# EAGLE design untitled (EAGLE 7.2.0)
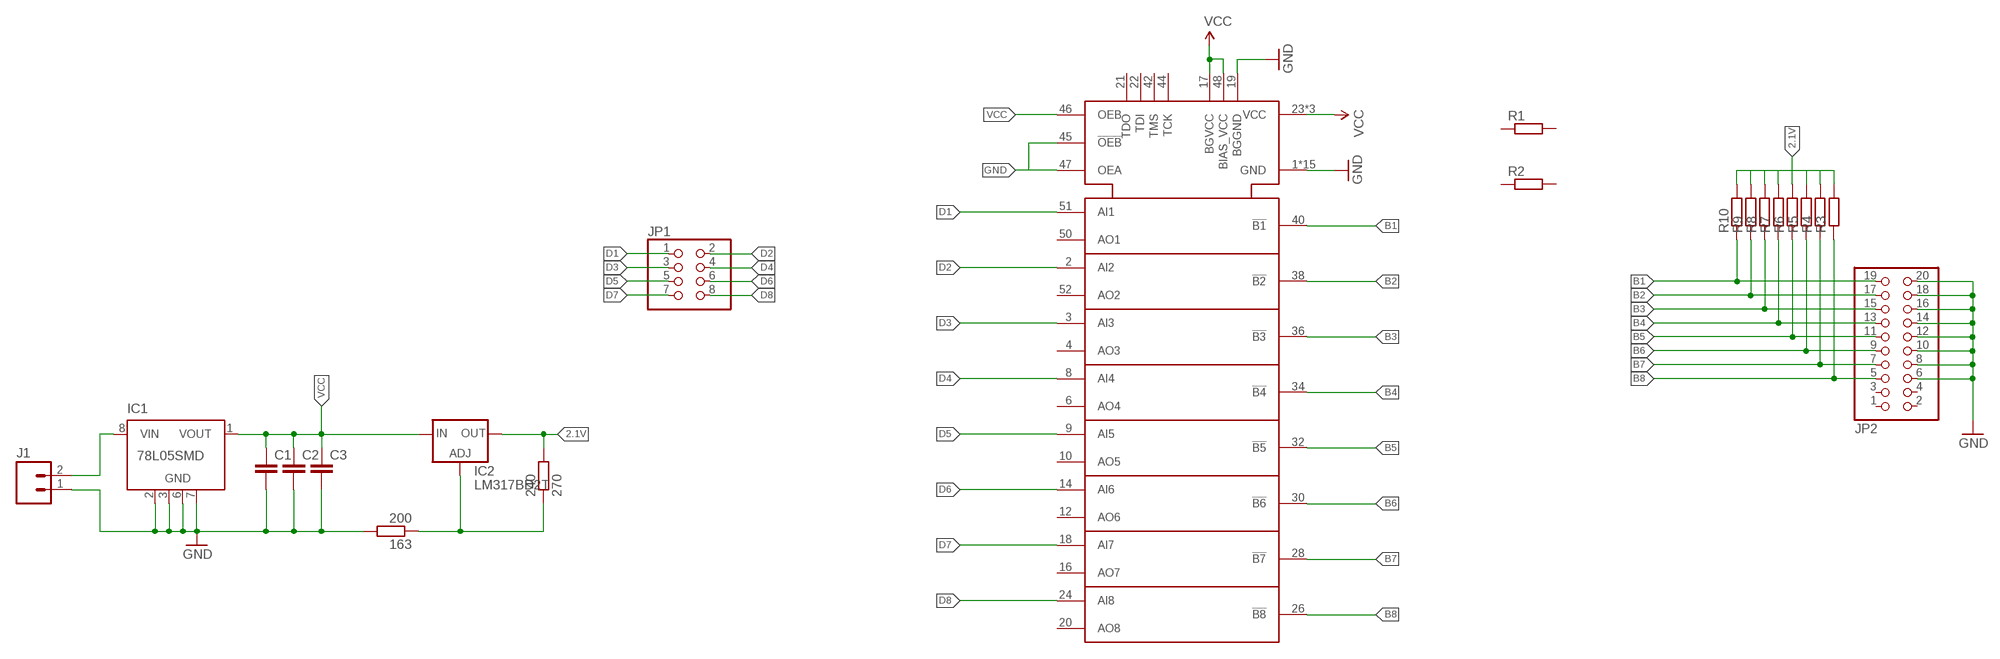
[diagram p0: schematic, sheet 1]

## Parts
163  200  R0805  [R0805]
240  270  R0805  [R0805]
C1  CC0805  [C0805]
C2  CC0805  [C0805]
C3  CC0805  [C0805]
IC1  78L05SMD  [SO08]
IC2  LM317BD2T  [D2PACK]
J1  M02LOCK_LONGPADS  [1X02_LOCK_LONGPADS]
JP1  PINHD-2X04_2.54-SMD  [2X04SMD]
JP2  PINHD-2X10_2.54-SMD  [2X10SMD]
R1  R0805  [R0805]
R2  R0805  [R0805]
R3  R0805  [R0805]
R4  R0805  [R0805]
R5  R0805  [R0805]
R6  R0805  [R0805]
R7  R0805  [R0805]
R8  R0805  [R0805]
R9  R0805  [R0805]
R10  R0805  [R0805]
U$1  SN74FB2050  [TQFP-10X10-52]

## Nets
2.1V: 240.2 IC2.2(OUT) R3.2 R4.2 R5.2 R6.2 R7.2 R8.2 R9.2 R10.2
B1: JP2.19 R10.1 U$1.40(!B1)
B2: JP2.17 R9.1 U$1.38(!B2)
B3: JP2.15 R8.1 U$1.36(!B3)
B4: JP2.13 R7.1 U$1.34(!B4)
B5: JP2.11 R6.1 U$1.32(!B5)
B6: JP2.9 R5.1 U$1.30(!B6)
B7: JP2.7 R4.1 U$1.28(!B7)
B8: JP2.5 R3.1 U$1.26(!B8)
D1: JP1.1 U$1.51(AI1)
D2: JP1.2 U$1.2(AI2)
D3: JP1.3 U$1.3(AI3)
D4: JP1.4 U$1.8(AI4)
D5: JP1.5 U$1.9(AI5)
D6: JP1.6 U$1.14(AI6)
D7: JP1.7 U$1.18(AI7)
D8: JP1.8 U$1.24(AI8)
GND: 163.2 C1.2 C2.2 C3.2 IC1.2(GND) IC1.3(GND) IC1.6(GND) IC1.7(GND) J1.1 JP2.6 JP2.8 JP2.10 JP2.12 JP2.14 JP2.16 JP2.18 JP2.20 U$1.1(GND) U$1.5(GND) U$1.7(GND) U$1.11(GND) U$1.13(GND) U$1.15(GND) U$1.19(BGGND) U$1.25(GND) U$1.27(GND) U$1.29(GND) U$1.31(GND) U$1.33(GND) U$1.35(GND) U$1.37(GND) U$1.39(GND) U$1.41(GND) U$1.45(!OEB) U$1.47(OEA)
N$1: IC1.8(VIN) J1.2
N$3: 163.1 240.1 IC2.1(ADJ)
VCC: C1.1 C2.1 C3.1 IC1.1(VOUT) IC2.3(IN) U$1.17(BGVCC) U$1.23(VCC) U$1.43(VCC) U$1.46(OEB) U$1.48(BIAS_VCC) U$1.49(VCC)
Unconnected: IC1.4(NC) IC1.5(NC) JP2.1 JP2.2 JP2.3 JP2.4 R1.1 R1.2 R2.1 R2.2 U$1.4(AO3) U$1.6(AO4) U$1.10(AO5) U$1.12(AO6) U$1.16(AO7) U$1.20(AO8) U$1.21(TDO) U$1.22(TDI) U$1.42(TMS) U$1.44(TCK) U$1.50(AO1) U$1.52(AO2)

## Library data of the parts
163 240 R1-R10 = smalsmd:R
C1-C3 = smalsmd:C: Capacitor
IC1 = linear:78L*SMD: Positive VOLTAGE REGULATOR
IC2 = v-reg:LM317?*: 500 mA Adjustable Output Positive Voltage Regulator Source: http://www.onsemi.co.jp .. LM317M-D.PDF
J1 = SparkFun-Connectors:M02: Standard 2-pin 0.1" header. Use with - straight break away headers ( PRT-00116) - right angle break away headers (PRT-00553) - swiss pins (PRT-00743) - machine pins (PRT-00117) - female headers (PRT-00115) Molex polarized connector foot print use with: PRT-08233 with associated crimp pins and housings. 2.54_SCREWTERM for use with PRT-10571. 3.5mm Screw Terminal footprints for PRT-08084 5mm Screw Terminal footprints for use with PRT-08432
JP1 = pinhead-2:PINHD-2X04: PIN HEADER
JP2 = pinhead-2:PINHD-2X10: PIN HEADER
U$1 = btl:SN74FB2050

## Board
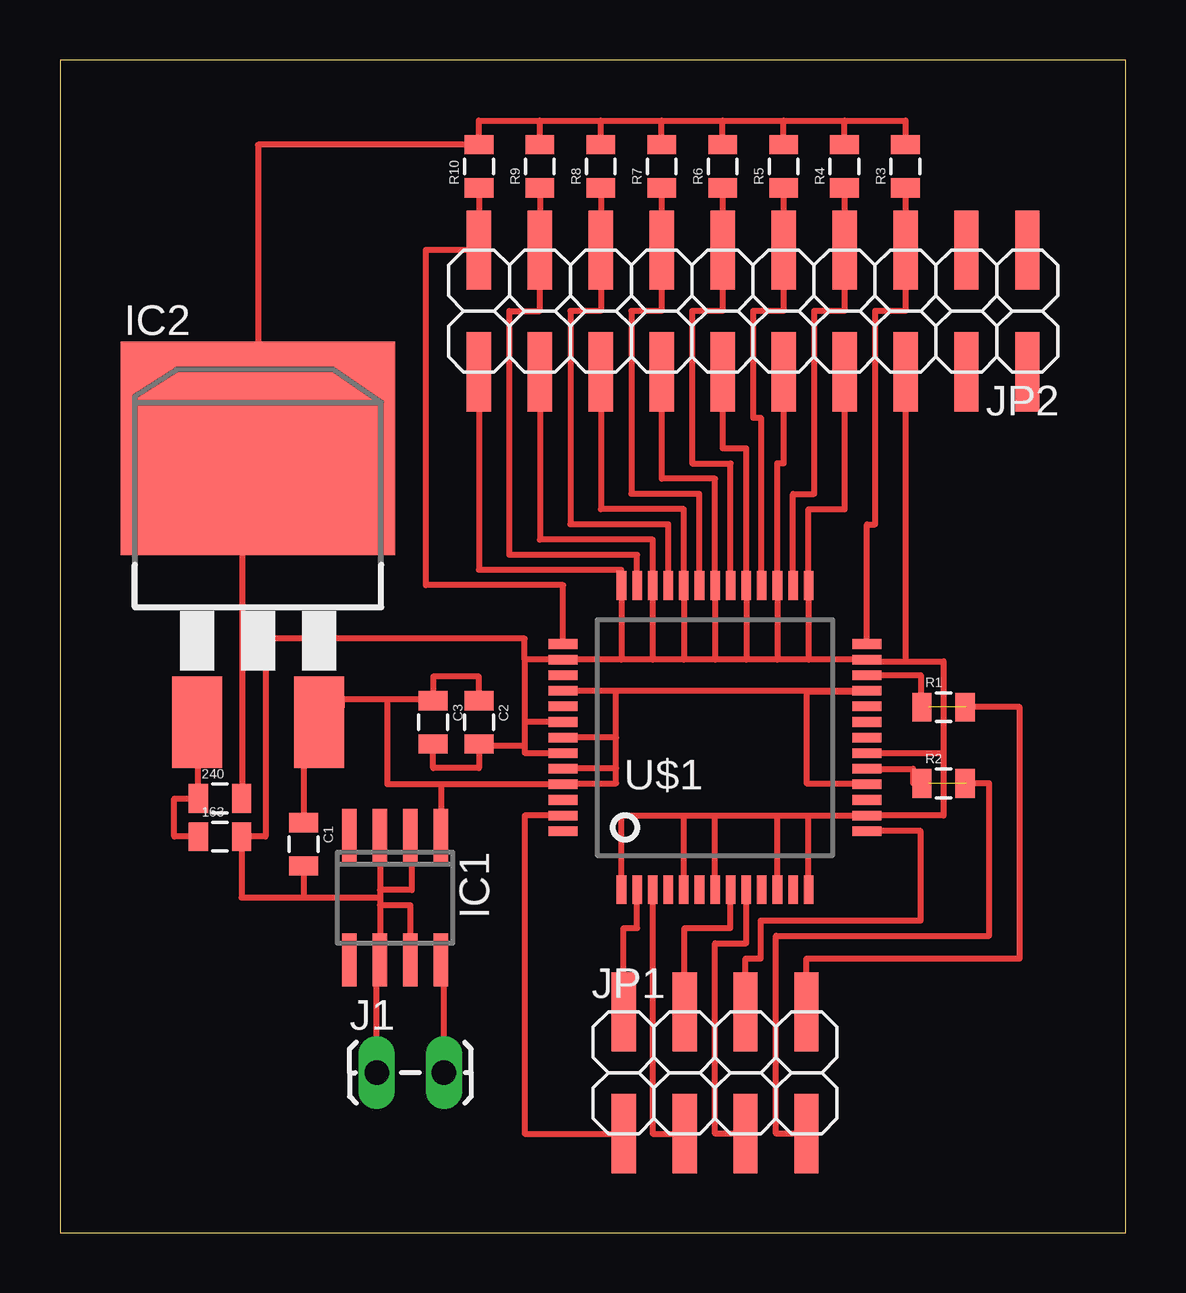
[diagram p1: board, top side]

Size 44.43 x 48.88 mm. Coordinates in mm from the lower left corner, seen from the top.
Outline: 0,0 44.43,0 44.43,48.88 0,48.88 0,0
Copper layers (1*16): Top 0.035mm / dielectric 1.5mm / Bottom 0.035mm
Design rules "default": minimum track width 10mil, minimum drill 24mil, track to track 8mil, track to pad 8mil, pad to pad 8mil, via to via 8mil, smd to smd 8mil, copper to edge 40mil, drill to drill 8mil, minimum pad ring 10mil, minimum via ring 8mil, stop-mask expansion 4mil, vias tented up to drill 0mil, thermal gap 10mil

### Footprints (pad centres in the part's own frame; a part is rotated, then mirrored left to right if it is on the bottom)
R0805 = smd 0.8 x 1.2: 1 -0.9,0; 2 0.9,0
C0805 = smd 0.8 x 1.2: 1 -0.9,0; 2 0.9,0
SO08 = smd 0.6 x 2.2: 1 -1.905,-2.6; 2 -0.635,-2.6; 3 0.635,-2.6; 4 1.905,-2.6; 5 1.905,2.6; 6 0.635,2.6; 7 -0.635,2.6; 8 -1.905,2.6
D2PACK = smd 2.083 x 3.81: 1 -2.54,-8.89; 3 2.54,-8.89 | smd 11.43 x 8.89: 2 0,2.54
1X02_LOCK_LONGPADS = drill 1.016 long: 1 -0.127,0; 2 2.667,0
2X04SMD = smd 1.016 x 3.302: 1 -1.27,-3.81; 2 -1.27,1.27; 3 1.27,-3.81; 4 1.27,1.27; 5 3.81,-3.81; 6 3.81,1.27; 7 6.35,-3.81; 8 6.35,1.27
2X10SMD = smd 1.016 x 3.302: 1 -1.27,-3.81; 2 -1.27,1.27; 3 1.27,-3.81; 4 1.27,1.27; 5 3.81,-3.81; 6 3.81,1.27; 7 6.35,-3.81; 8 6.35,1.27; 9 8.89,-3.81; 10 8.89,1.27; 11 11.43,-3.81; 12 11.43,1.27; 13 13.97,-3.81; 14 13.97,1.27; 15 16.51,-3.81; 16 16.51,1.27; 17 19.05,-3.81; 18 19.05,1.27; 19 21.59,-3.81; 20 21.59,1.27
TQFP-10X10-52 = smd 0.4 x 1.2: 1 -3.9,-6.335; 2 -3.25,-6.335; 3 -2.6,-6.335; 4 -1.95,-6.335; 5 -1.3,-6.335; 6 -0.65,-6.335; 7 0,-6.335; 8 0.65,-6.335; 9 1.3,-6.335; 10 1.95,-6.335; 11 2.6,-6.335; 12 3.25,-6.335; 13 3.9,-6.335; 27 3.9,6.335; 28 3.25,6.335; 29 2.6,6.335; 30 1.95,6.335; 31 1.3,6.335; 32 0.65,6.335; 33 0,6.335; 34 -0.65,6.335; 35 -1.3,6.335; 36 -1.95,6.335; 37 -2.6,6.335; 38 -3.25,6.335; 39 -3.9,6.335 | smd 1.2 x 0.4: 14 6.335,-3.9; 15 6.335,-3.25; 16 6.335,-2.6; 17 6.335,-1.95; 18 6.335,-1.3; 19 6.335,-0.65; 20 6.335,0; 21 6.335,0.65; 22 6.335,1.3; 23 6.335,1.95; 24 6.335,2.6; 25 6.335,3.25; 26 6.335,3.9; 40 -6.335,3.9; 41 -6.335,3.25; 42 -6.335,2.6; 43 -6.335,1.95; 44 -6.335,1.3; 45 -6.335,0.65; 46 -6.335,0; 47 -6.335,-0.65; 48 -6.335,-1.3; 49 -6.335,-1.95; 50 -6.335,-2.6; 51 -6.335,-3.25; 52 -6.335,-3.9

### Placement (x,y rotation side)
163  6.67,16.51 0 top
240  6.67,18.1 0 top
C1  10.16,16.19 270 top
C2  17.46,21.27 270 top
C3  15.56,21.27 270 top
IC1  13.97,13.97 180 top
IC2  8.26,30.16 0 top
J1  13.34,6.67 0 top
JP1  24.77,7.94 0 top
JP2  39.05,37.15 180 top
R1  36.83,21.91 0 top
R2  36.83,18.73 0 top
R3  35.24,44.45 90 top
R4  32.7,44.45 90 top
R5  30.16,44.45 90 top
R6  27.62,44.45 90 top
R7  25.08,44.45 90 top
R8  22.54,44.45 90 top
R9  20,44.45 90 top
R10  17.46,44.45 90 top
U$1  27.3,20.64 0 top

### Tracks (layer width: path | path; a pad name or v marks a point on that pad's centre or on a via)
2.1V
  Top 0.254: 20,46.35 17.46,46.35 R10.2 8.26,45.35 IC2.2 7.62,32.7 7.62,18.1 240.2 | 20,46.35 22.54,46.35 | 22.54,46.35 25.08,46.35 | 25.08,46.35 27.62,46.35 | 27.62,46.35 30.16,46.35 | 30.16,46.35 32.7,46.35 | 32.7,46.35 35.24,46.35 R3.2 | R4.2 32.7,46.35 | R5.2 30.16,46.35 | R6.2 27.62,46.35 | R7.2 25.08,46.35 | R8.2 22.54,46.35 | R9.2 20,46.35
B1
  Top 0.254: U$1.40 20.97,26.99 15.24,26.99 15.24,40.96 JP2.19 R10.1
B2
  Top 0.254: U$1.38 24.05,28.26 18.73,28.26 18.73,38.42 20,38.42 JP2.17 R9.1
B3
  Top 0.254: U$1.36 25.36,29.53 21.27,29.53 21.27,38.42 22.54,38.42 JP2.15 R8.1
B4
  Top 0.254: U$1.34 26.66,30.8 23.81,30.8 23.81,38.42 25.08,38.42 JP2.13 R7.1
B5
  Top 0.254: U$1.32 27.95,32.07 26.35,32.07 26.35,38.42 27.62,38.42 JP2.11 R6.1
B6
  Top 0.254: U$1.30 29.21,26.97 29.21,33.97 28.89,33.97 28.89,38.42 30.16,38.42 JP2.9 R5.1
B7
  Top 0.254: U$1.28 30.55,30.8 31.43,30.8 31.43,38.42 32.7,38.42 JP2.7 R4.1
B8
  Top 0.254: U$1.26 33.64,29.53 33.97,29.53 33.97,38.42 35.24,38.42 JP2.5 R3.1
D1
  Top 0.254: U$1.51 19.37,17.39 19.37,4.13 JP1.1
D2
  Top 0.254: JP1.2 23.5,12.7 24.05,12.7 U$1.2
D3
  Top 0.254: U$1.3 24.7,4.13 JP1.3
D4
  Top 0.254: JP1.4 26.04,12.7 27.94,12.7 U$1.8
D5
  Top 0.254: JP1.5 27.3,4.13 27.3,12.06 28.61,12.06 U$1.9
D6
  Top 0.254: JP1.6 28.57,11.43 29.21,11.43 29.21,13.02 35.88,13.02 35.88,16.74 U$1.14
D7  (1 unrouted)
  Top 0.254: U$1.18 35.56,19.34 35.56,18.73 36.2,18.73 | JP1.7 29.84,4.13 29.84,12.38 38.73,12.38 38.73,18.73 37.78,18.73
D8  (1 unrouted)
  Top 0.254: U$1.24 35.88,23.24 35.88,21.91 36.2,21.91 | JP1.8 31.11,11.43 40.01,11.43 40.01,21.91 37.78,21.91 37.78,21.59
GND
  Top 0.254: 31.2,23.89 U$1.25 33.64,23.81 35.24,23.81 | 31.2,23.89 29.91,23.89 | 29.91,23.89 28.61,23.89 | 28.61,23.89 27.3,23.89 | 27.3,23.89 26,23.89 | 26,23.89 24.7,23.89 | 24.7,23.89 23.41,23.89 | 23.41,23.89 U$1.41 19.37,23.89 | U$1.1 23.41,17.39 26,17.39 | 26,17.39 27.3,17.39 | 27.3,17.39 29.91,17.39 | 29.91,17.39 31.2,17.39 | 31.2,17.39 U$1.15 36.83,17.39 36.83,19.99 | U$1.13 31.2,17.39 | U$1.11 29.91,17.39 | U$1.7 27.3,17.39 | U$1.5 26,17.39 | 35.24,23.81 36.83,23.81 36.83,19.99 | 33.64,20 U$1.19 36.83,19.99 | 23.41,23.89 U$1.39 23.41,27.62 17.46,27.62 JP2.20 | U$1.31 28.57,26.97 | JP2.18 20,28.89 24.7,28.89 U$1.37 24.7,23.89 | JP2.16 22.54,30.16 26,30.16 U$1.35 26,23.89 | JP2.14 25.08,31.43 27.3,31.43 U$1.33 27.3,23.89 | JP2.12 27.62,32.7 28.61,32.7 U$1.31 | JP2.10 30.16,32.07 29.91,32.07 U$1.29 29.91,23.89 | JP2.8 32.7,30.16 31.2,30.16 U$1.27 31.2,23.89 | JP2.6 35.24,23.81 | U$1.31 28.61,23.89 | 19.37,23.89 19.37,21.29 | 19.37,21.29 19.37,20.32 | 19.37,20.32 19.37,20 20.97,20 U$1.47 | U$1.45 19.37,21.29 | IC1.2 14.66,16.57 14.66,14.29 13.34,14.29 | IC1.3 13.34,14.29 | 13.34,14.29 13.34,13.97 | 13.34,13.97 13.34,13.65 | 13.34,13.65 IC1.6 13.21,11.37 J1.1 | IC1.7 14.61,13.65 13.34,13.65 | 10.16,13.97 7.57,13.97 163.2 8.57,16.51 8.57,24.77 19.37,24.77 19.37,23.89 | 10.16,13.97 13.34,13.97 | C1.2 10.16,13.97 | 19.37,20.32 17.46,20.32 C2.2 17.46,19.37 15.56,19.37 C3.2
N$1
  Top 0.254: J1.2 16,11.37 IC1.8
N$3
  Top 0.254: 163.1 4.76,16.51 4.76,18.1 240.1 5.77,21.27 IC2.1
VCC
  Top 0.254: 23.18,22.59 U$1.23 33.64,22.54 31.11,22.54 31.11,18.73 33.64,18.73 U$1.17 | 23.18,22.59 U$1.43 | 23.18,19.37 23.18,18.73 20.97,18.73 U$1.49 15.88,18.69 | 23.18,20.64 23.18,22.59 | U$1.48 20.97,19.37 23.18,19.37 | 23.18,19.37 23.18,20.64 | 23.18,20.64 U$1.46 | 11.75,22.23 10.79,22.23 IC2.3 10.16,21.27 C1.1 | 15.88,18.69 IC1.1 | 11.75,22.23 11.75,21.91 | C2.1 17.46,23.18 15.56,23.18 C3.1 15.56,22.23 13.65,22.23 | 13.65,22.23 11.75,22.23 | 15.88,18.69 13.65,18.69 13.65,22.23